# Altium project MCP3202.PrjPcb
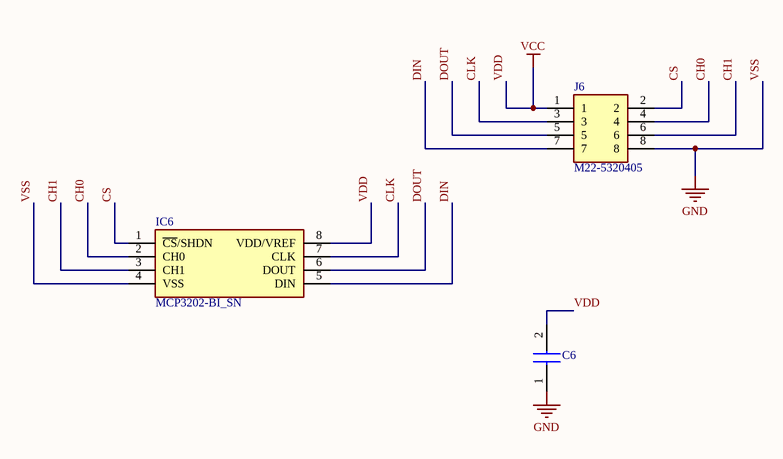
[diagram p0: MCP3202.SchDoc]
1 sheet, 3 parts. Net scope: global (net labels, ports and power ports of the same name join across sheets).
Board file: MCP3202.PcbDoc

## Sheet MCP3202.SchDoc
size A

### Parts
C6  GRM21BR71C105MA01K  [CAPC2012X145N]  (value not drawn)
IC6  MCP3202-BI_SN  [SOIC127P600X175-8N]
J6  M22-5320405  [HUSSP8W50P200_2X4_800X400X500P]

### Nets
VDD: C6.2 IC6.8(VDD/VREF) J6.1  [also labelled VCC]
VSS: C6.1 IC6.4(VSS) J6.8  [also labelled GND]
CH0: IC6.2(CH0) J6.4
CH1: IC6.3(CH1) J6.6
CLK: IC6.7(CLK) J6.3
CS: IC6.1(~{CS}/SHDN) J6.2
DIN: IC6.5(DIN) J6.7
DOUT: IC6.6(DOUT) J6.5

### Library data of the parts
C6 = GRM21BR71C105MA01K: Capacitor; Manufacturer_Name: Murata Electronics; Datasheet Link: http://www.murata.com/~/media/webrenewal/support/library/catalog/products/capacitor/mlcc/c02e.pdf; Height: 1.45mm; Manufacturer_Part_Number: GRM21BR71C105MA01K; Mouser Part Number: 81-GRM21R71C105MA01K; Mouser Price/Stock: https://www.mouser.co.uk/ProductDetail/Murata-Electronics/GRM21BR71C105MA01K?qs=%252BOhj5xpo0CKX2ExPHNXi%252Bg%3D%3D
IC6 = MCP3202-BI_SN: Integrated Circuit; Manufacturer_Name: Microchip; Manufacturer_Part_Number: MCP3202-BI/SN; Datasheet Link: https://datasheet.datasheetarchive.com/originals/distributors/Datasheets-19/DSA-360813.pdf; Height: 1.75mm; Mouser Part Number: 579-MCP3202BISN; Mouser Price/Stock: https://www.mouser.co.uk/ProductDetail/Microchip-Technology/MCP3202-BI-SN?qs=C%252BuF95oynlkGMhp5%2FSqbew%3D%3D; Arrow Part Number: MCP3202-BI/SN; Arrow Price/Stock: https://www.arrow.com/en/products/mcp3202-bisn/microchip-technology?region=nac
J6 = M22-5320405: Connector; Manufacturer_Name: Harwin; Datasheet Link: https://cdn.harwin.com/pdfs/M22-532.pdf; Manufacturer_Part_Number: M22-5320405; Mouser Part Number: 855-M22-5320405; Mouser Price/Stock: https://www.mouser.co.uk/ProductDetail/Harwin/M22-5320405?qs=WS5Jv%252B%252Bx1qVxYYIoWES7kw%3D%3D